# EasyEDA Pro project BrushedDC_Alpha_1_0.eprj

# Schematic Schematic1
Create Date: 2024-08-11; Page Name: P1; Project Name: BrushedDC_Alpha_1_0; Schematic Name: Schematic1; Update Date: 2024-08-12; Company: Silicon WorkGroup; Page Size: A3; Version: Alpha1.0
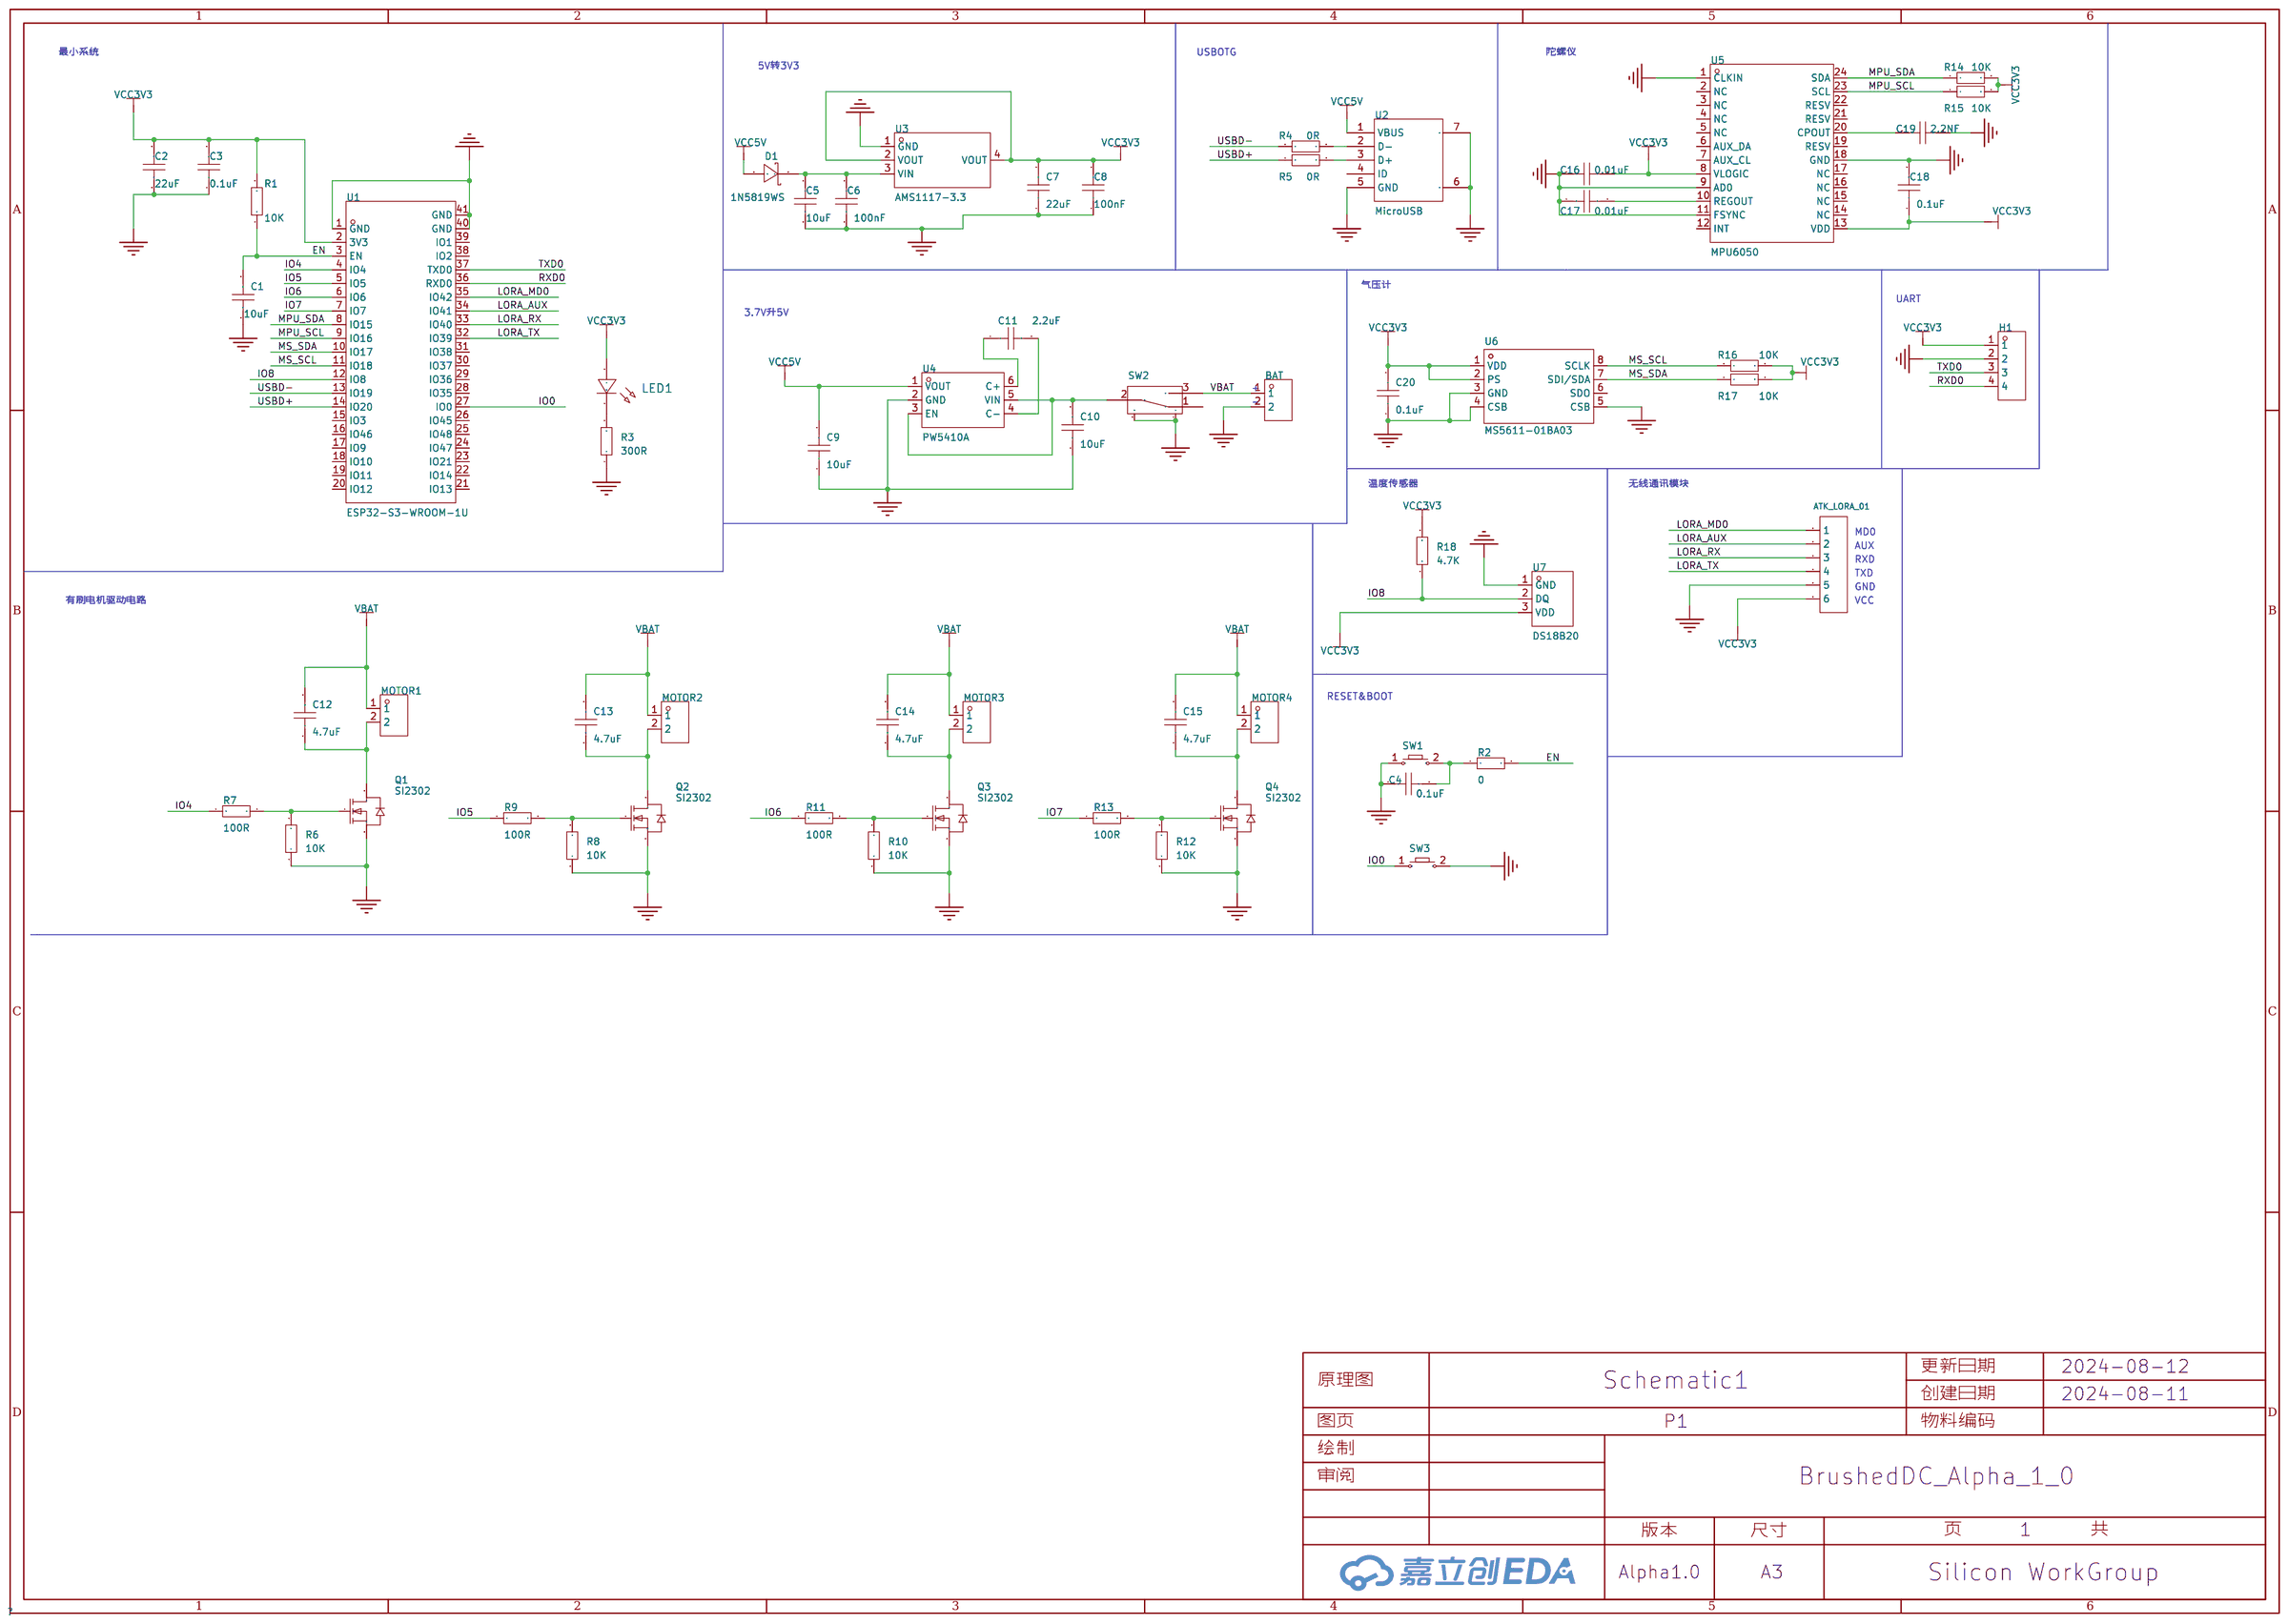
[diagram p0: schematic sheet]

## Parts
ATK_LORA_01  -  [HDR-TH_6P-P2.54-V-M-1]
BAT  B2B-ZR-K(LF)(SN)  [CONN-TH_2P-P1.50_JST_B2B-ZR-K]
C1  10uF  [C0805]
C2  22uF  [C0805]
C3  0.1uF  [C0805]
C4  0.1uF  [C0805]
C5  10uF  [C0805]
C6  100nF  [C0805]
C7  22uF  [C0805]
C8  100nF  [C0805]
C9  10uF  [C0805]
C10  10uF  [C0805]
C11  2.2uF  [C0805]
C12  4.7uF  [C0805]
C13  4.7uF  [C0805]
C14  4.7uF  [C0805]
C15  4.7uF  [C0805]
C16  0.01uF  [C0805]
C17  0.01uF  [C0805]
C18  0.1uF  [C0805]
C19  2.2NF  [C0805]
C20  0.1uF  [C0805]
D1  1N5819WS  [SOD-323_L1.8-W1.3-LS2.5-RD]
H1  -  [HDR-TH_4P-P2.54-V-M]
LED1  -  [LED_0805]
MOTOR1  B2B-ZR-K(LF)(SN)  [CONN-TH_2P-P1.50_JST_B2B-ZR-K]
MOTOR2  B2B-ZR-K(LF)(SN)  [CONN-TH_2P-P1.50_JST_B2B-ZR-K]
MOTOR3  B2B-ZR-K(LF)(SN)  [CONN-TH_2P-P1.50_JST_B2B-ZR-K]
MOTOR4  B2B-ZR-K(LF)(SN)  [CONN-TH_2P-P1.50_JST_B2B-ZR-K]
Q1  SI2302  [SOT-23-3_L2.9-W1.3-P1.90-LS2.4-BR]
Q2  SI2302  [SOT-23-3_L2.9-W1.3-P1.90-LS2.4-BR]
Q3  SI2302  [SOT-23-3_L2.9-W1.3-P1.90-LS2.4-BR]
Q4  SI2302  [SOT-23-3_L2.9-W1.3-P1.90-LS2.4-BR]
R1  10K  [R0805]
R2  0  [R0805]
R3  300R  [R0805]
R4  0R  [R0805]
R5  0R  [R0805]
R6  10K  [R0805]
R7  100R  [R0805]
R8  10K  [R0805]
R9  100R  [R0805]
R10  10K  [R0805]
R11  100R  [R0805]
R12  10K  [R0805]
R13  100R  [R0805]
R14  10K  [R0805]
R15  10K  [R0805]
R16  10K  [R0805]
R17  10K  [R0805]
R18  4.7K  [R0805]
SW1  -  [Key_SMD_3x4x2]
SW2  -  [拨动开关_侧]
SW3  -  [Key_SMD_3x4x2]
U1  ESP32-S3-WROOM-1U  [WIRELM-SMD_ESP32-S3-WROOM-1U]
U2  MicroUSB  [USB-SMD_C9900013631]
U3  AMS1117-3.3  [SOT-223-3_L6.5-W3.4-P2.30-LS7.0-BR]
U4  PW5410A  [SOT-23-6_L2.9-W1.6-P0.95-LS2.8-BL]
U5  MPU6050  [QFN-24_L4.0-W4.0-P0.50-BL]
U6  MS5611-01BA03  [SENSORS-SMD_MS5611-01BA03]
U7  DS18B20  [TO-92-3_L4.9-W3.7-P1.27-L]

## Library data of the parts
ATK_LORA_01 = HDR-M_2.54_1x6P: Supplier Part: C37208; Supplier Footprint: 插件
BAT MOTOR1-MOTOR4 = B2B-ZR-K(LF)(SN): 插针结构:1x2P;间距:1.5mm;安装方式:直插;参考系列:ZH;总PIN数:2P;排数:1;每排PIN数:2;行距:-;额定电流:1A;触头材质:黄铜;触头镀层:锡;工作温度范围:-25℃~+85℃;; LCSC Part Name: 1x2P 间距:1.5mm 直插 系列:ZH; Supplier Part: C565960; Manufacturer: JST; Supplier Footprint: 插件,P=1.5mm; JLCPCB Part Class: 扩展库; Datasheet: https://atta.szlcsc.com/upload/public/pdf/source/20181010/C265435_265A0E364DE7AFA8D888C9DA34FBB2A6.pdf; Supplier: LCSC; Pins Structure: 1x2P; Pitch: 1.5mm; Mounting Style: 直插; Reference Series: ZH; Number of Pins: 2P; Number of Rows: 1; Number of PINs Per Row: 2; Current Rating (Max): 1A; Contact Material: 黄铜; Contact Plating: 锡; Operating Temperature Range: -25℃~+85℃; Rated Voltage (Max): 50V; Plastic Material: 玻纤增强PA66; Flame Retardant Rating: UL94V-0; Colour: 黑色; Z-Height of the Board: 4.5mm; X-Length of Bottom Edge on Board (Spacing Line): 4.5mm; Y-Width of Bottom Edge on Board: 3.5mm
C1-C3 C5-C11 C16-C20 = CAP_0805: Supplier Footprint: 0805
C4 C12-C15 = CAP_0603: Supplier Footprint: 0603
D1 = 1N5819WS_C191023: 正向压降(Vf):600mV@1A;直流反向耐压(Vr):40V;平均整流电流(Io):1A;; LCSC Part Name: 电压:40V 电流:1A; Supplier Part: C191023; Manufacturer: Hottech(合科泰); Supplier Footprint: SOD-323; JLCPCB Part Class: 基础库; Datasheet: https://atta.szlcsc.com/upload/public/pdf/source/20220428/3CB86FD8D28D653594B4E35F9D5AEFD9.pdf; Supplier: LCSC; Forward Voltage (Vf@If): 600mV@1A; Reverse Voltage (Vr): 40V; Average Rectified Current (Io): 1A
H1 = HDR-M_2.54_1x4P: Supplier Part: C492403; Supplier Footprint: 插件
LED1 = LED_0805-R: Supplier Footprint: 0805
Q1-Q4 = SI2302: 类型:1个N沟道;漏源电压(Vdss):20V;连续漏极电流(Id):2.6A;功率(Pd):900mW;导通电阻(RDS(on)@Vgs,Id):85mΩ@4.5V,2.6A;阈值电压(Vgs(th)@Id):1.5V@250uA;; LCSC Part Name: 1个N沟道 耐压:20V 电流:2.6A; Supplier Part: C2841377; Manufacturer: TECH PUBLIC(台舟); Supplier Footprint: SOT-23-3; JLCPCB Part Class: 扩展库; Datasheet: https://atta.szlcsc.com/upload/public/pdf/source/20210810/B45106B571BB908B9120BCB1C1283335.pdf; Supplier: LCSC; Type: 1个N沟道; Drain Source Voltage (Vdss): 20V; Continuous Drain Current (Id): 2.6A; Power Dissipation (Pd): 900mW; Drain Source On Resistance (RDS(on)@Vgs,Id): 85mΩ@4.5V,2.6A; Gate Threshold Voltage (Vgs(th)@Id): 1.5V@250uA; Input Capacitance (Ciss@Vds): 880pF@6V
R1-R18 = Res_0805: Supplier Footprint: 0805
SW1 SW3 = Key_SMD_3x4x2: Supplier Footprint: SMD
SW2 = 拨动开关_侧: Supplier Footprint: 插件
U1 = ESP32-S3-WROOM-1U: Supplier Part: C9900027631; JLCPCB Part Class: 扩展库; Supplier: LCSC
U2 = MicroUSB: Supplier Part: C9900013631; Supplier Footprint: USBmini; JLCPCB Part Class: 扩展库; Supplier: LCSC
U3 = AMS1117-3.3_C6186: 输出类型:固定;最大输入电压:-;输出电压:3.3V;最大输出电流:1A;电源纹波抑制比(PSRR):72dB@(120Hz);输出极性:正极;; LCSC Part Name: 输出3.3V 1A; Supplier Part: C6186; Manufacturer: AMS; Supplier Footprint: SOT-223; JLCPCB Part Class: 基础库; Datasheet: https://atta.szlcsc.com/upload/public/pdf/source/20180727/C6186_7A095716F0823C02F1997A905E26C086.pdf; Supplier: LCSC; Output Type: 固定; Output Voltage: 3.3V; MAX Output Current: 1A; Power Supply Rejection Ratio (PSRR): 72dB@(120Hz); Dropout Voltage: 1.3V@(800mA); Output Polarity: 正极; Number of Outputs: 1
U4 = PW5410A: Supplier Part: C9900093484; Supplier Footprint: SOT23-6L; JLCPCB Part Class: 扩展库; Supplier: LCSC
U5 = MPU6050: Supplier Part: C9900042518; Supplier Footprint: QFN-24_L4.0-W4.0-P0.50-BL-EP2.7; Supplier: LCSC
U6 = MS5611-01BA03: 不锈钢帽的气压传感器，工作电压：1.8V~3.6V; Supplier Part: C37148; Manufacturer: MEAS; Supplier Footprint: QFN-8(3x5); JLCPCB Part Class: 扩展库; Datasheet: https://atta.szlcsc.com/upload/public/pdf/source/20140924/1457707242210.pdf; Supplier: LCSC
U7 = DS18B20: 温度范围:-55℃~+125℃;精度:±0.4℃;接口类型:-;; Supplier Part: C376006; Manufacturer: UMW(友台半导体); Supplier Footprint: TO-92; JLCPCB Part Class: 扩展库; Datasheet: https://atta.szlcsc.com/upload/public/pdf/source/20231109/DC3DA9D47D486EF40A6E0F08B9A498E3.pdf; Supplier: LCSC; Temperature range: -55℃~+125℃; Resolution: ±0.4℃; Supply Voltage: 3V~5.5V

## Nets
GND: ATK_LORA_01.5 BAT.2 C1.1 C2.1 C3.1 C4.1 C5.1 C6.1 C7.1 C8.1 C9.1 C10.1 C16.1 C17.1 C18.2 C19.2 C20.1 H1.2 Q1.2(S) Q2.2(S) Q3.2(S) Q4.2(S) R3.1 R6.1 R8.1 R10.1 R12.1 SW1.1 SW2.4 SW2.5 SW3.2 U1.1(GND) U1.40(GND) U1.41(GND) U2.5(GND) U2.6(EH) U2.7(EH) U3.1(GND) U4.2(GND) U5.1(CLKIN) U5.9(AD0) U5.11(FSYNC) U5.18(GND) U6.3(GND) U6.4(CSB) U6.5(CSB) U7.1(GND)
VBAT: BAT.1 C12.2 C13.2 C14.2 C15.2 MOTOR1.1 MOTOR2.1 MOTOR3.1 MOTOR4.1 SW2.3
VCC3V3: ATK_LORA_01.6 C2.2 C3.2 C7.2 C8.2 C16.2 C18.1 C20.2 H1.1 LED1.2(A) R1.2 R14.2 R15.2 R16.2 R17.2 R18.2 U1.2(3V3) U3.2(VOUT) U3.4(VOUT) U5.8(VLOGIC) U5.13(VDD) U6.1(VDD) U6.2(PS) U7.3(VDD)
VCC5V: C9.2 D1.2(A) U2.1(VBUS) U4.1(VOUT)
EN: C1.2 R1.1 R2.2 U1.3(EN)
IO0: SW3.1 U1.27(IO0)
IO4: R7.1 U1.4(IO4)
IO5: R9.1 U1.5(IO5)
IO6: R11.1 U1.6(IO6)
IO7: R13.1 U1.7(IO7)
IO8: R18.1 U1.12(IO8) U7.2(DQ)
LORA_AUX: ATK_LORA_01.2 U1.34(IO41)
LORA_MD0: ATK_LORA_01.1 U1.35(IO42)
LORA_RX: ATK_LORA_01.3 U1.33(IO40)
LORA_TX: ATK_LORA_01.4 U1.32(IO39)
MPU_SCL: R15.1 U1.9(IO16) U5.23(SCL)
MPU_SDA: R14.1 U1.8(IO15) U5.24(SDA)
MS_SCL: R16.1 U1.11(IO18) U6.8(SCLK)
MS_SDA: R17.1 U1.10(IO17) U6.7(SDI/SDA)
RXD0: H1.4 U1.36(RXD0)
TXD0: H1.3 U1.37(TXD0)
USBD+: R5.1 U1.14(IO20)
USBD-: R4.1 U1.13(IO19)
$1N931: LED1.1(C) R3.2
$1N1204: R4.2 U2.2(D-)
$1N1207: R5.2 U2.3(D+)
$1N2324: C11.2 U4.4(C-)
$1N2331: C11.1 U4.6(C+)
$1N2346: C10.2 SW2.2 U4.3(EN) U4.5(VIN)
$1N2447: C5.2 C6.2 D1.1(K) U3.3(VIN)
$1N2715: C12.1 MOTOR1.2 Q1.3(D)
$1N2833: Q1.1(G) R6.2 R7.2
$1N3080: C13.1 MOTOR2.2 Q2.3(D)
$1N3089: Q2.1(G) R8.2 R9.2
$1N3287: C14.1 MOTOR3.2 Q3.3(D)
$1N3296: Q3.1(G) R10.2 R11.2
$1N3494: C15.1 MOTOR4.2 Q4.3(D)
$1N3503: Q4.1(G) R12.2 R13.2
$1N4028: C17.2 U5.10(REGOUT)
$1N4177: C19.1 U5.20(CPOUT)
$1N5203: C4.2 R2.1 SW1.2

Not connected (* = marked no-connect by the designer): SW2 1; U1 15(IO3) 16(IO46) 17(IO9) 18(IO10) 19(IO11) 20(IO12) 21(IO13) 22(IO14) 23(IO21) 24(IO47) 25(IO48) 26(IO45) 28(IO35) 29(IO36) 30(IO37) 31(IO38) 38(IO2) 39(IO1); U2 4(ID); U5 2(NC) 3(NC) 4(NC) 5(NC) 6(AUX_DA) 7(AUX_CL) 12(INT) 14(NC) 15(NC) 16(NC) 17(NC) 19(RESV) 21(RESV) 22(RESV); U6 6(SDO)

## Notes on the sheet
- 最小系统
- USBOTG
- 陀螺仪
- 5V转3V3
- 气压计
- UART
- 3.7V升5V
- +
- -
- 温度传感器
- 无线通讯模块
- AUX
- MD0
- RXD
- TXD
- GND
- 有刷电机驱动电路
- VCC
- RESET&BOOT

# Board PCB1
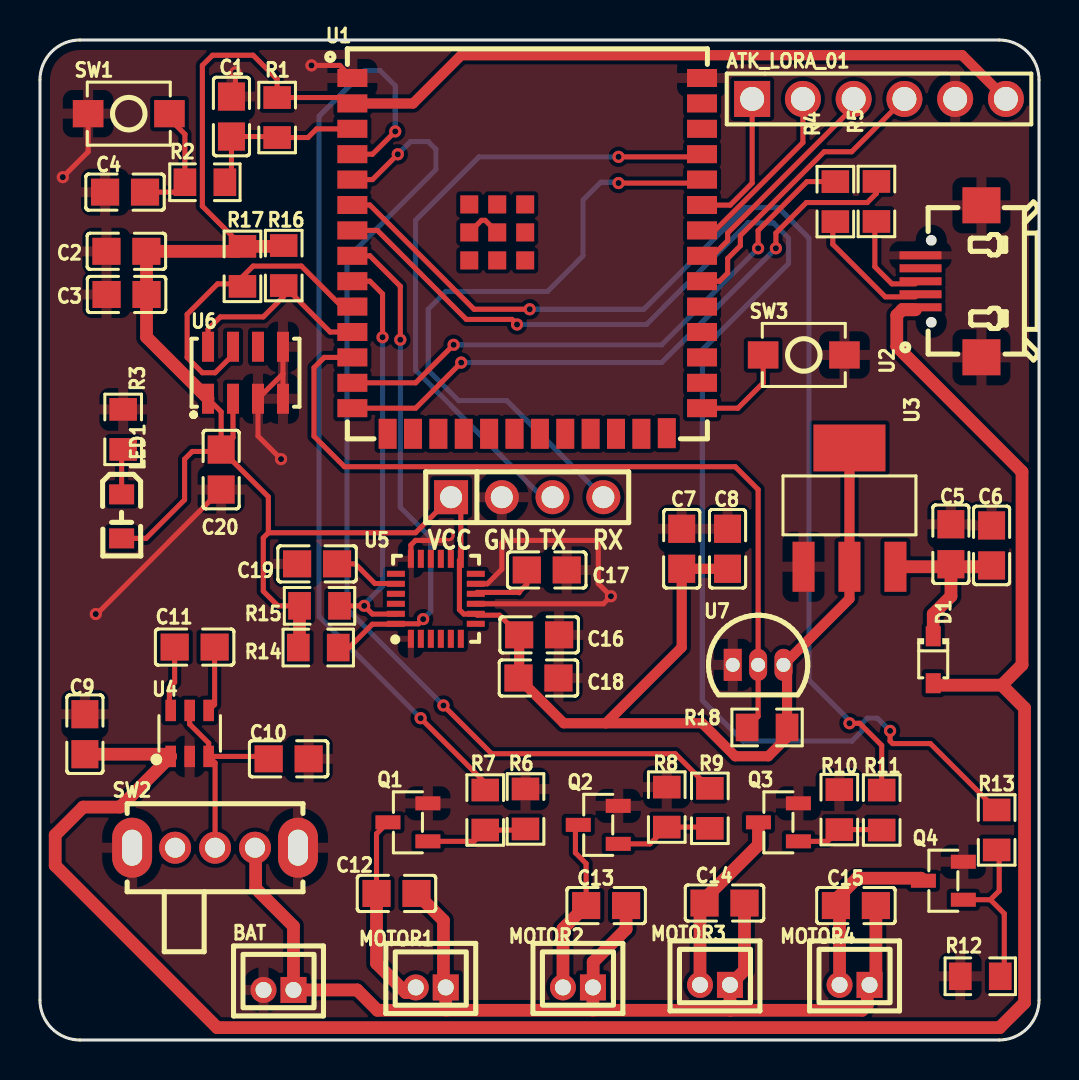
[diagram p1: board, top side]
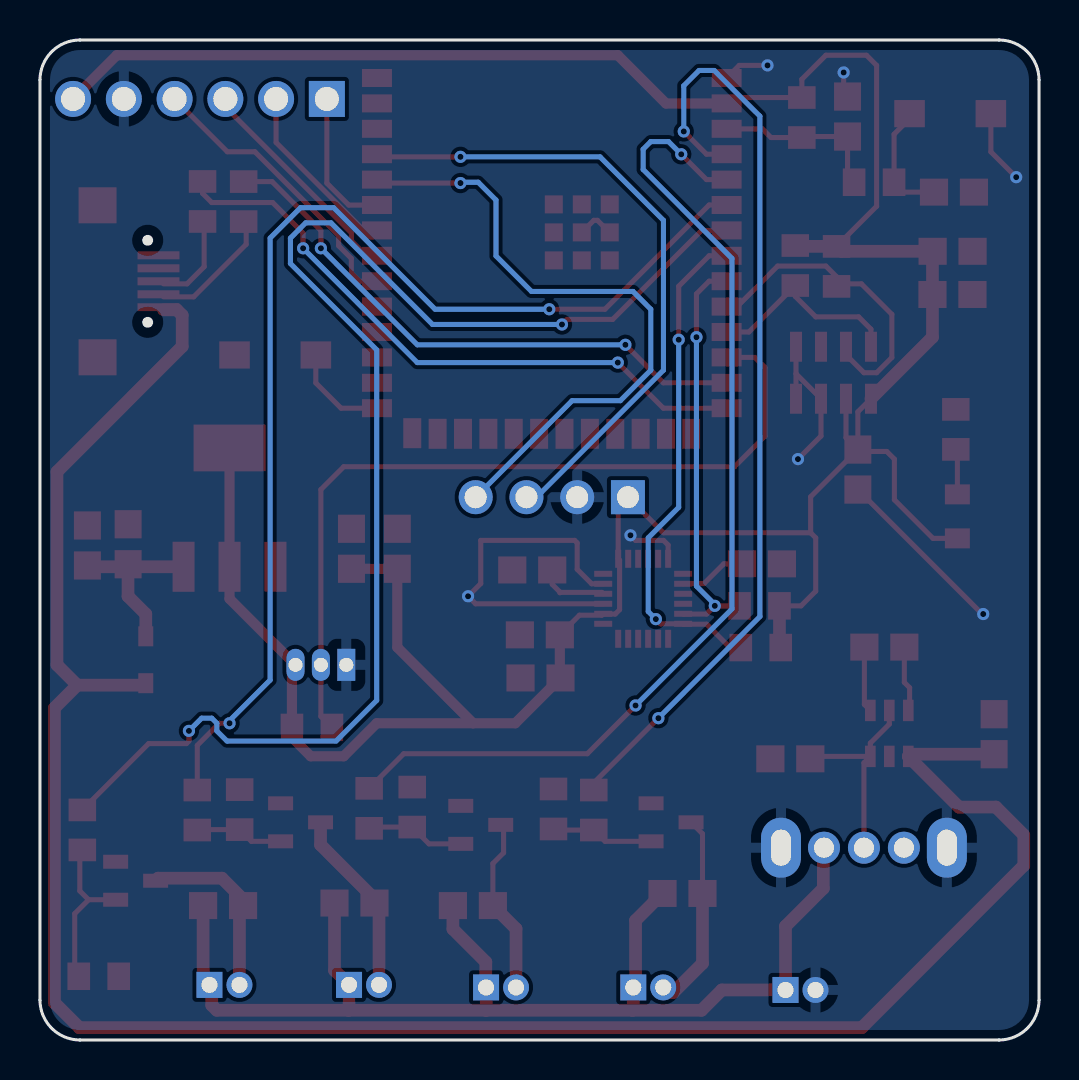
[diagram p2: board, bottom side, seen from below]

Outline 50 x 50 mm; copper layers: Top Layer, Bottom Layer. Coordinates in mm from the lower left corner of the outline.
Outline path: 0,48 0,2 arc(0.59,0.59) 2,0 48,0 arc(49.41,0.59) 50,2 50,48 arc(49.41,49.41) 48,50 2,50 arc(0.59,49.41) 0,48
Stack: Top Layer 0.035mm / Dielectric1 1.51mm FR4 er 4.5 / Bottom Layer 0.035mm

## Design rules (mm)
template: 自定义配置
spacing copperThickness1oz (default): track to track 0.102, other pairs 0.152 to 0.3
spacing copperThickness2oz: track to track 0.203, other pairs 0.152 to 0.3
spacing 3mil: track to track 0.152, other pairs 0.076 to 0.3
track width copperThickness1oz (default): min 0.127, default 0.254, max 2.54
track width copperThickness2oz: min 0.203, default 0.254, max 2.54
track width 40mil: min 0.635, default 0.635, max 0.635
track width 20mil: min 0.381, default 0.508, max 0.508
differential pair differentialPair (default): width min 0.127, default 0.254, max 2.54; gap min 0.152, default 0.152
via viaSize (default): diameter min 0.5, default 0.61, max 10; hole min 0.3, default 0.305, max 6.299
net VCC3V3 uses 20mil
net VCC5V uses 40mil
net VBAT uses 40mil

## Placement (name value [footprint] x y rotation side)
ATK_LORA_01  -  [HDR-TH_6P-P2.54-V-M-1]  41.99 47.05 0 top
BAT  B2B-ZR-K(LF)(SN)  [CONN-TH_2P-P1.50_JST_B2B-ZR-K]  11.94 2.5 0 top
C1  10uF  [C0805]  9.58 46.17 270 top
C2  22uF  [C0805]  4.33 39.44 0 top
C3  0.1uF  [C0805]  4.33 37.28 0 top
C4  0.1uF  [C0805]  4.26 42.39 0 top
C5  10uF  [C0805]  45.59 24.79 270 top
C6  100nF  [C0805]  47.62 24.73 270 top
C7  22uF  [C0805]  32.12 24.56 270 top
C8  100nF  [C0805]  34.41 24.56 270 top
C9  10uF  [C0805]  2.25 15.29 270 top
C10  10uF  [C0805]  12.45 14.06 180 top
C11  2.2uF  [C0805]  7.74 19.64 0 top
C12  4.7uF  [C0805]  17.84 7.33 0 top
C13  4.7uF  [C0805]  28.33 6.72 0 top
C14  4.7uF  [C0805]  34.26 6.85 0 top
C15  4.7uF  [C0805]  40.84 6.72 0 top
C16  0.01uF  [C0805]  24.98 20.26 180 top
C17  0.01uF  [C0805]  25.36 23.5 180 top
C18  0.1uF  [C0805]  24.95 18.1 0 top
C19  2.2NF  [C0805]  13.87 23.81 180 top
C20  0.1uF  [C0805]  9.07 28.52 90 top
D1  1N5819WS  [SOD-323_L1.8-W1.3-LS2.5-RD]  44.7 19.01 270 top
H1  -  [HDR-TH_4P-P2.54-V-M]  24.38 27.14 0 top
LED1  -  [LED_0805]  4.08 26.13 270 top
MOTOR1  B2B-ZR-K(LF)(SN)  [CONN-TH_2P-P1.50_JST_B2B-ZR-K]  19.56 2.63 0 top
MOTOR2  B2B-ZR-K(LF)(SN)  [CONN-TH_2P-P1.50_JST_B2B-ZR-K]  26.92 2.63 0 top
MOTOR3  B2B-ZR-K(LF)(SN)  [CONN-TH_2P-P1.50_JST_B2B-ZR-K]  33.78 2.76 0 top
MOTOR4  B2B-ZR-K(LF)(SN)  [CONN-TH_2P-P1.50_JST_B2B-ZR-K]  40.77 2.76 0 top
Q1  SI2302  [SOT-23-3_L2.9-W1.3-P1.90-LS2.4-BR]  18.42 10.88 0 top
Q2  SI2302  [SOT-23-3_L2.9-W1.3-P1.90-LS2.4-BR]  27.94 10.76 0 top
Q3  SI2302  [SOT-23-3_L2.9-W1.3-P1.90-LS2.4-BR]  36.96 10.88 0 top
Q4  SI2302  [SOT-23-3_L2.9-W1.3-P1.90-LS2.4-BR]  45.21 7.96 0 top
R1  10K  [R0805]  11.87 46.12 90 top
R2  0  [R0805]  8.25 42.89 0 top
R3  300R  [R0805]  4.16 30.53 270 top
R4  0R  [R0805]  39.81 41.92 270 top
R5  0R  [R0805]  41.86 41.93 270 top
R6  10K  [R0805]  24.3 11.55 270 top
R7  100R  [R0805]  22.28 11.5 270 top
R8  10K  [R0805]  31.37 11.65 270 top
R9  100R  [R0805]  33.52 11.58 270 top
R10  10K  [R0805]  40 11.52 270 top
R11  100R  [R0805]  42.13 11.5 270 top
R12  10K  [R0805]  47.06 3.19 0 top
R13  100R  [R0805]  47.88 10.5 270 top
R14  10K  [R0805]  13.93 19.62 180 top
R15  10K  [R0805]  13.99 21.71 180 top
R16  10K  [R0805]  12.2 38.72 90 top
R17  10K  [R0805]  10.13 38.68 90 top
R18  4.7K  [R0805]  36.39 15.63 0 top
SW1  -  [Key_SMD_3x4x2]  4.44 46.32 0 top
SW2  -  [拨动开关_侧]  8.76 9.61 0 top
SW3  -  [Key_SMD_3x4x2]  38.23 34.25 0 top
U1  ESP32-S3-WROOM-1U  [WIRELM-SMD_ESP32-S3-WROOM-1U]  24.38 39.2 0 top
U2  MicroUSB  [USB-SMD_C9900013631]  45.59 37.94 90 top
U3  AMS1117-3.3  [SOT-223-3_L6.5-W3.4-P2.30-LS7.0-BR]  40.51 26.63 270 top
U4  PW5410A  [SOT-23-6_L2.9-W1.6-P0.95-LS2.8-BL]  7.49 15.33 0 top
U5  MPU6050  [QFN-24_L4.0-W4.0-P0.50-BL]  19.81 22.06 0 top
U6  MS5611-01BA03  [SENSORS-SMD_MS5611-01BA03]  10.29 33.36 0 top
U7  DS18B20  [TO-92-3_L4.9-W3.7-P1.27-L]  35.94 18.76 0 top

## Footprints (pads in the part's own frame, mm; a bottom-side part is the same pattern mirrored in y, then rotated)
C0805
  rect 1.41x1.35 smd: 1(-1,0) 2(1,0)
CONN-TH_2P-P1.50_JST_B2B-ZR-K
  rect 1.3x1.3 hole 0.8: 1(0.75,0)
  round 1.3 hole 0.8: 2(-0.75,0)
HDR-TH_4P-P2.54-V-M
  rect 1.7x1.7 hole 1.1: 1(-3.81,0)
  round 1.7 hole 1.1: 2(-1.27,0) 3(1.27,0) 4(3.81,0)
HDR-TH_6P-P2.54-V-M-1
  rect 1.8x1.8 hole 1.2: 1(-6.35,0)
  round 1.8 hole 1.2: 2(-3.81,0) 3(-1.27,0) 4(1.27,0) 5(3.81,0) 6(6.35,0)
Key_SMD_3x4x2
  rect 1.53x1.36 smd: 1(-2.035,0) 2(2.035,0)
LED_0805
  rect 1x1.25 smd: 1(-1.15,0.005) 2(1.05,0.005)
QFN-24_L4.0-W4.0-P0.50-BL
  rect 0.3x0.9 smd: 1(-1.25,-2) 2(-0.75,-2) 3(-0.25,-2) 4(0.25,-2) 5(0.75,-2) 6(1.25,-2) 13(1.25,2) 14(0.75,2) 15(0.25,2) 16(-0.25,2) 17(-0.75,2) 18(-1.25,2)
  rect 0.9x0.3 smd: 7(2,-1.25) 8(2,-0.75) 9(2,-0.25) 10(2,0.25) 11(2,0.75) 12(2,1.25) 19(-2,1.25) 20(-2,0.75) 21(-2,0.25) 22(-2,-0.25) 23(-2,-0.75) 24(-2,-1.25)
R0805
  rect 1.133x1.377 smd: 1(-1,0) 2(1,0)
SENSORS-SMD_MS5611-01BA03
  rect 0.6x1.5 smd: 1(-1.875,-1.3) 2(-0.625,-1.3) 3(0.625,-1.3) 4(1.875,-1.3) 5(1.875,1.3) 6(0.625,1.3) 7(-0.625,1.3) 8(-1.875,1.3)
SOD-323_L1.8-W1.3-LS2.5-RD
  rect 1x0.75 smd: 1(-1.173,0) 2(1.173,0)
SOT-23-3_L2.9-W1.3-P1.90-LS2.4-BR
  rect 1.25x0.7 smd: 1(1,-0.95) 2(1,0.95) 3(-1,0)
SOT-23-6_L2.9-W1.6-P0.95-LS2.8-BL
  rect 0.532x1.072 smd: 1(-0.95,-1.149) 2(0,-1.149) 3(0.95,-1.149) 4(0.95,1.149) 5(0,1.149) 6(-0.95,1.149)
SOT-223-3_L6.5-W3.4-P2.30-LS7.0-BR
  rect 2.5x1.1 smd: 1(2.97,-2.3) 2(2.97,0) 3(2.97,2.3)
  rect 2.34x3.6 smd: 4(-2.97,0)
TO-92-3_L4.9-W3.7-P1.27-L
  rect 0.9x1.6 hole 0.7: 1(-1.27,0)
  oval 0.9x1.6 hole 0.7: 2(0,0) 3(1.27,0)
USB-SMD_C9900013631
  rect 0.4x2.1 smd: 1(-1.3,1.525) 2(-0.65,1.525) 3(0,1.525) 4(0.65,1.525) 5(1.3,1.525)
  rect 1.8x1.9 smd: 6(3.8,-1.524) 7(-3.8,-1.525)
WIRELM-SMD_ESP32-S3-WROOM-1U
  rect 1.5x0.9 smd: 1(-8.75,8.895) 2(-8.75,7.625) 3(-8.75,6.355) 4(-8.75,5.085) 5(-8.75,3.815) 6(-8.75,2.545) 7(-8.75,1.275) 8(-8.75,0.005) 9(-8.75,-1.265) 10(-8.75,-2.535) 11(-8.75,-3.805) 12(-8.75,-5.075) 13(-8.75,-6.345) 14(-8.75,-7.615) 27(8.75,-7.615) 28(8.75,-6.345) 29(8.75,-5.075) 30(8.75,-3.805) 31(8.75,-2.535) 32(8.75,-1.265) 33(8.75,0.005) 34(8.75,1.275) 35(8.75,2.545) 36(8.75,3.815) 37(8.75,5.085) 38(8.75,6.355) 39(8.75,7.625) 40(8.75,8.895)
  rect 0.9x1.5 smd: 15(-6.985,-8.895) 16(-5.715,-8.895) 17(-4.445,-8.895) 18(-3.175,-8.895) 19(-1.905,-8.895) 20(-0.635,-8.895) 21(0.635,-8.895) 22(1.905,-8.895) 23(3.175,-8.895) 24(4.445,-8.895) 25(5.715,-8.895) 26(6.985,-8.865)
  rect 0.9x0.9 smd: 41(-2.9,2.575) 41(-2.9,1.175) 41(-2.9,-0.225) 41(-1.5,2.575) 41(-1.5,1.175) 41(-1.5,-0.225) 41(-0.1,2.575) 41(-0.1,1.175) 41(-0.1,-0.225)
拨动开关_侧
  oval 1.6x1.6 hole 1.001: 1(-1.999,0) 2(0,0) 3(1.999,0)
  oval 1.999x2.999 hole 1.001x1.801: 4(4.151,0) 5(-4.151,0)

## Nets
As in the schematic.

Pads without a net: SW2 1; U1 15 16 17 18 19 20 21 22 23 24 25 26 28 29 30 31 38 39; U2 4; U5 2 3 4 5 6 7 12 14 15 16 17 19 21 22; U6 6

## Via types
v1: diameter 0.61, hole 0.305, Top Layer to Bottom Layer, 25 vias

## Routing (per net, layer and track width the routed paths; a pad name or vN(x,y) marks a point on that pad's centre or on a via; arc(x,y) is an arc through that point)
GND: length 46.3
  Top Layer w0.254: U1.1 15,48.73 13.72,48.73 ; U6.5 12.16,33.31 ; 12.16,33.31 U6.3 10.91,30.2 v1(12.06,29.05) ; 12.16,33.31 U6.4 ; C1.1 9.78,47.37 v1(9.78,48.38) ; U5.18 18.56,24.75 18.8,24.98 20.19,24.98 v1(20.45,25.23) ; v1(1.14,43.14) 2.41,44.41 SW1.1 ; U5.11 22.39,22.81 23.11,23.53 23.11,24.85 23.24,24.98 27.94,24.98 27.94,22.82 v1(28.58,22.19) 28.2,21.81 U5.9 ; C20.1 2.84,21.3 v1(2.79,21.3) ; U1.41 22.28,40.98 22.1,40.98 21.49,40.38 U1.41
  vias: v1(13.59,48.73)
VBAT: length 60.4
  Top Layer w0.635: 34.55,1.49 34.53,1.51 MOTOR3.1 35.26,3.48 C14.2 ; 34.55,1.49 27.68,1.49 ; 34.55,1.49 41.15,1.49 41.4,1.74 41.4,2.64 MOTOR4.1 41.84,3.07 C15.2 ; SW2.3 10.8,9.58 10.8,7.58 12.69,5.69 BAT.1 15.87,2.5 16.89,1.49 20.34,1.49 ; 27.68,1.49 27.67,1.49 MOTOR2.1 27.69,2.64 27.69,3.9 29.33,5.55 C13.2 ; 27.68,1.49 20.34,1.49 ; 20.34,1.49 20.31,1.52 MOTOR1.1 20.19,2.74 20.19,5.98 C12.2
VCC3V3: length 159.8
  Top Layer w0.254: R17.2 8.13,41.69 8.13,48.73 8.64,49.24 10.67,49.24 11.87,48.04 R1.2 15.34,47.12 U1.2 ; U6.1 9.07,31.41 C20.2 ; C16.2 23,21.24 21.88,21.24 U5.8 21.8,21.3 21.21,21.3 20.99,21.52 20.99,23.99 U5.13 21.06,26.65 H1.1 18.8,25.36 11.43,25.36 ; C20.2 9.66,30.12 U6.2 ; C20.2 8.97,29.43 7.62,29.43 7.24,29.05 7.24,27.01 5.31,25.08 LED1.2 ; C20.2 11.43,27.16 11.43,25.36 ; 11.43,25.36 11.18,25.11 11.18,22.44 11.91,21.71 R15.2
  Top Layer w0.508: 28.32,15.84 33.15,15.84 34.8,14.19 36.45,14.19 37.39,15.13 R18.2 37.39,18.58 U7.3 40.51,22.06 U3.4 ; 28.32,15.84 26.21,15.84 C18.1 23.98,18.13 C16.2 ; 28.32,15.84 32.12,19.63 C7.2 C8.2 ; ATK_LORA_01.6 46.16,49.24 21.08,49.24 18.67,46.83 15.64,46.83 U1.2
  Top Layer w0.635: U6.1 5.33,35.14 C3.2 5.33,39.43 C2.2 9.89,39.44 R17.2 12.16,39.68 R16.2 ; R15.2 12.99,19.69 R14.2
VCC5V: length 108
  Top Layer w0.635: 48.13,17.74 44.8,17.74 D1.2 ; 48.13,17.74 49.28,16.6 49.28,1.87 48.03,0.62 8.87,0.62 0.76,8.72 0.76,10.25 2.16,11.65 4.01,11.65 U4.1 6.43,14.29 C9.2 ; 48.13,17.74 49.15,18.76 49.15,28.41 42.88,34.68 42.88,36.24 43.15,36.51 43.81,36.51
EN: length 8.7
  Top Layer w0.254: R2.2 9.58,43.22 C1.2 11.82,45.17 R1.1 13.41,45.12 13.84,45.55 15.63,45.55 U1.3
IO0: length 5
  Top Layer w0.254: U1.27 34.93,31.59 36.2,32.86 36.2,34.25 SW3.1
IO4: length 47.1
  Top Layer w0.254: R7.1 22.28,12.86 v1(19.05,16.09) ; v1(17.78,45.43) 16.64,44.29 U1.4
  Bottom Layer w0.254: v1(17.78,45.43) 17.78,47.71 17.02,48.48 16.26,48.48 13.97,46.19 13.97,21.17 v1(19.05,16.09)
IO5: length 51.8
  Top Layer w0.254: U1.5 16.64,43.02 v1(17.91,44.28) ; R9.1 31.8,14.31 22.61,14.31 v1(20.19,16.73)
  Bottom Layer w0.254: v1(20.19,16.73) 15.37,21.55 15.37,39.08 19.81,43.52 19.81,44.54 19.43,44.92 18.54,44.92 v1(17.91,44.28)
IO6: length 56.8
  Top Layer w0.254: U1.6 16.51,41.75 21.72,36.54 v1(24.51,36.54) ; 40.77,15.84 41.02,15.84 42.13,14.73 R11.1
  Bottom Layer w0.254: 40.51,15.96 38.48,18 38.48,40.09 36.96,41.62 35.31,41.62 30.23,36.54 v1(24.51,36.54)
  vias: v1(40.51,15.84)
IO7: length 69.4
  Top Layer w0.254: 42.55,15.33 42.55,14.95 42.67,14.82 44.56,14.82 R13.1 ; v1(23.88,35.78) 23.62,36.03 21.34,36.03 16.89,40.48 U1.7
  Bottom Layer w0.254: v1(23.88,35.78) 30.35,35.78 35.43,40.86 36.7,40.86 37.46,40.09 37.46,38.82 33.15,34.51 33.15,16.98 35.18,14.95 40.64,14.95 41.15,15.46 41.15,15.84 41.4,16.09 41.91,16.09 v1(42.55,15.46)
IO8: length 41
  Top Layer w0.254: R18.1 35.94,16.18 U7.2 35.94,27.52 34.8,28.66 15.24,28.66 13.72,30.19 13.72,33.62 14.23,34.13 U1.12
LORA_AUX: length 9
  Top Layer w0.254: ATK_LORA_01.2 38.18,44.88 33.79,40.48 U1.34
LORA_MD0: length 7.2
  Top Layer w0.254: U1.35 33.14,41.75 34.54,41.75 35.64,42.84 ATK_LORA_01.1
LORA_RX: length 11.3
  Top Layer w0.254: U1.33 33.66,39.21 34.42,39.97 34.42,40.35 40.72,46.65 ATK_LORA_01.3
LORA_TX: length 14.6
  Top Layer w0.254: ATK_LORA_01.4 40.62,44.41 39.24,44.41 35.05,40.22 35.05,39.71 34.42,39.08 34.42,38.35 34.01,37.94 U1.32
MPU_SCL: length 20.8
  Top Layer w0.254: U1.9 16.51,37.94 17.14,37.31 v1(17.14,35.14) ; R15.1 v1(16.23,21.71) 16.64,21.3 17.8,21.3 U5.23
  Bottom Layer w0.254: 16.13,21.68 17.14,22.69 v1(17.14,35.14)
MPU_SDA: length 25.3
  Top Layer w0.254: v1(19.18,21.04) 18.94,20.81 U5.24 17.79,20.79 16.64,20.79 15.47,19.62 R14.1 ; U1.8 16.51,39.21 18.03,37.69 v1(18.03,35.01)
  Bottom Layer w0.254: v1(19.18,21.04) 19.56,21.42 19.56,25.11 18.03,26.63 v1(18.03,35.01)
MS_SCL: length 10.3
  Top Layer w0.254: U6.8 8.41,35.54 9.03,36.16 11.18,36.16 12.2,37.18 R16.1 14.52,35.4 U1.11
MS_SDA: length 16
  Top Layer w0.254: U6.7 9.66,34.26 8.76,33.36 8.13,33.36 7.37,34.12 7.37,36.28 8.89,37.81 10.01,37.81 R17.1 10.13,38.16 10.67,38.7 13.08,38.7 15.11,36.67 U1.10
RXD0: length 32.4
  Top Layer w0.254: U1.36 32.96,42.85 v1(28.96,42.85)
  Bottom Layer w0.254: H1.4 23.37,31.97 20.95,31.97 19.43,33.49 19.43,36.54 20.32,37.43 25.4,37.43 27.18,39.2 27.18,42 28.07,42.89 28.83,42.89
TXD0: length 32.7
  Top Layer w0.254: v1(28.96,44.16) 33,44.16 U1.37
  Bottom Layer w0.254: H1.3 25.15,27.14 18.8,33.49 18.8,40.98 21.97,44.16 v1(28.96,44.16)
USBD+: length 31.7
  Top Layer w0.254: U1.14 18.8,31.59 v1(21.08,33.87) ; R5.1 41.86,42.33 41.4,41.87 38.35,41.87 36.83,40.35 v1(36.83,39.59)
  Bottom Layer w0.254: v1(36.83,39.59) 31.11,33.87 v1(21.08,33.87)
USBD-: length 28.9
  Top Layer w0.254: v1(35.94,39.59) 35.94,40.47 38.39,42.92 R4.1 ; U1.13 18.8,32.86 v1(20.7,34.76)
  Bottom Layer w0.254: v1(35.94,39.59) 31.11,34.76 v1(20.7,34.76)
$1N931: length 2.3
  Top Layer w0.254: LED1.1 4.09,29.45 R3.2
$1N1204: length 6.4
  Top Layer w0.254: 43.81,37.16 42.31,37.16 39.68,39.78 39.68,40.92
$1N1207: length 4.7
  Top Layer w0.254: R5.2 41.78,40.85 41.78,38.66 42.64,37.81 43.81,37.81
$1N2324: length 3.3
  Top Layer w0.254: C11.2 8.74,16.78 U4.4
$1N2331: length 3.3
  Top Layer w0.254: U4.6 6.48,16.54 6.48,17.61 6.74,17.88 C11.1
$1N2346: length 10.4
  Top Layer w0.254: C10.2 11.33,14.18 U4.3 ; SW2.2 8.76,13.86 U4.3 ; U4.5 7.49,15.79 8.44,14.84 U4.3
$1N2447: length 8.8
  Top Layer w0.254: 45.59,23.66 45.59,23.78 C5.2
  Top Layer w0.635: 45.59,23.66 45.59,22.19 44.7,21.3 D1.1 ; 45.59,23.66 47.56,23.66 C6.2 ; 45.59,23.66 42.81,23.66
$1N2715: length 10
  Top Layer w0.254: Q1.3 16.84,10.31 C12.1
  Top Layer w0.635: C12.1 16.84,3.83 18.3,2.38 18.55,2.38 MOTOR1.2
$1N2833: length 5.1
  Top Layer w0.254: R6.2 24.25,10.5 R7.2 21.72,9.93 Q1.1
$1N3080: length 8.9
  Top Layer w0.254: Q2.3 26.8,10.61 26.8,9.36 27.33,8.82 C13.1
  Top Layer w0.635: MOTOR2.2 26.17,5.56 C13.1
$1N3089: length 5
  Top Layer w0.254: R9.2 33.46,10.65 R8.2 30.53,9.81 Q2.1
$1N3287: length 9.3
  Top Layer w0.635: MOTOR3.2 33.03,6.49 33.26,6.72 33.26,7.06 35.96,9.76 Q3.3
$1N3296: length 4.4
  Top Layer w0.254: R11.2 42.11,10.52 R10.2 39.42,9.93 Q3.1
$1N3494: length 9.2
  Top Layer w0.635: MOTOR4.2 40.02,6.41 39.84,6.59 39.84,7.03 40.89,8.09 44.08,8.09 Q4.3
$1N3503: length 8.3
  Top Layer w0.254: 48.44,3.19 48.26,3.36 48.26,6.32 47.56,7.01 ; Q4.1 47.56,7.01 ; 47.56,7.01 48.01,7.45 48.01,9.25 48.26,9.5
$1N4028: length 3.5
  Top Layer w0.254: C17.2 24.36,22.78 23.96,22.38 ; U5.10 21.88,22.38 23.96,22.38 ; 23.96,22.38 23.98,22.36
$1N4177: length 3.4
  Top Layer w0.254: C19.1 15.78,23.81 16.76,22.82 17.8,22.82 U5.20
$1N5203: length 6.4
  Top Layer w0.254: 5.97,46.57 7.25,45.29 R2.1 6.76,42.39 C4.2

## Copper pours and planes (outline as drawn; the poured copper is in the pictures)
GND on Top Layer: -0.64,50.38 50.93,50.38 50.93,-0.67 -0.64,-0.67
GND on Bottom Layer: -1.4,50.89 50.93,50.89 50.93,-0.93 -1.4,-0.93

## Text on the board
Top Silkscreen Layer: VCC | GND | TX | RX
